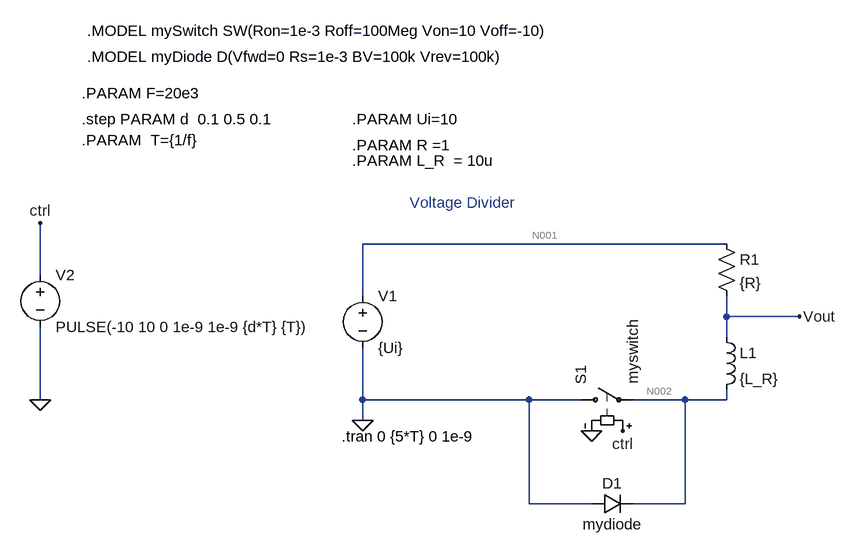
[diagram p0: schematic Switched_L.asc]
Switched_L.asc, the LTspice schematic file:
Version 4
SHEET 1 880 680
WIRE 560 80 0 80
WIRE -496 128 -496 48
WIRE 0 160 0 80
WIRE 560 192 560 160
WIRE 672 192 560 192
WIRE 560 224 560 192
WIRE -496 320 -496 208
WIRE 0 320 0 240
WIRE 256 320 0 320
WIRE 336 320 256 320
WIRE 496 320 416 320
WIRE 560 320 560 304
WIRE 560 320 496 320
WIRE 0 352 0 320
WIRE 256 480 256 320
WIRE 352 480 256 480
WIRE 496 480 496 320
WIRE 496 480 416 480
FLAG 0 352 0
FLAG 672 192 Vout
FLAG 352 368 0
FLAG 400 368 ctrl
FLAG -496 320 0
FLAG -496 48 ctrl
SYMBOL res 544 64 R0
SYMATTR InstName R1
SYMATTR Value {R}
SYMBOL voltage 0 144 R0
WINDOW 123 0 0 Left 0
WINDOW 39 0 0 Left 0
SYMATTR InstName V1
SYMATTR Value {Ui}
SYMBOL ind 544 208 R0
SYMATTR InstName L1
SYMATTR Value {L_R}
SYMBOL sw 320 320 R270
SYMATTR InstName S1
SYMATTR Value myswitch
SYMBOL voltage -496 112 R0
WINDOW 123 0 0 Left 0
WINDOW 39 0 0 Left 0
SYMATTR InstName V2
SYMATTR Value PULSE(-10 10 0 1e-9 1e-9 {d*T} {T})
SYMBOL diode 352 496 R270
WINDOW 0 32 32 VTop 2
WINDOW 3 0 32 VBottom 2
SYMATTR InstName D1
SYMATTR Value mydiode
TEXT -32 376 Left 2 !.tran 0 {5*T} 0 1e-9
TEXT 72 16 Left 2 ;Voltage Divider
TEXT -16 -112 Left 2 !.PARAM Ui=10
TEXT -16 -72 Left 2 !.PARAM R =1
TEXT -432 -152 Left 2 !.PARAM F=20e3
TEXT -432 -112 Left 2 !.step PARAM d  0.1 0.5 0.1
TEXT -432 -80 Left 2 !.PARAM  T={1/f}
TEXT -424 -248 Left 2 !.MODEL mySwitch SW(Ron=1e-3 Roff=100Meg Von=10 Voff=-10)
TEXT -424 -208 Left 2 !.MODEL myDiode D(Vfwd=0 Rs=1e-3 BV=100k Vrev=100k)
TEXT -16 -48 Left 2 !.PARAM L_R  = 10u

The netlist it stands for:
* Switched_L.asc
R1 N001 Vout {R}
V1 N001 0 {Ui}
L1 Vout N002 {L_R}
S1 0 N002 ctrl 0 myswitch
V2 ctrl 0 PULSE(-10 10 0 1e-9 1e-9 {d*T} {T})
D1 0 N002 mydiode
.model D D
.lib standard.dio
.tran 0 {5*T} 0 1e-9
* Voltage Divider
.PARAM Ui=10
.PARAM R =1
.PARAM F=20e3
.step PARAM d  0.1 0.5 0.1
.PARAM  T={1/f}
.MODEL mySwitch SW(Ron=1e-3 Roff=100Meg Von=10 Voff=-10)
.MODEL myDiode D(Vfwd=0 Rs=1e-3 BV=100k Vrev=100k)
.PARAM L_R  = 10u
.backanno
.end

* Results of the author's LTspice run, read from the files saved beside the schematic
* Operating Point (first step), zero values left out:
*   d = 100 m
*   V(n001) = 10 V
*   V(vout) = 10 V
*   V(n002) = 10 V
*   V(ctrl) = -10 V
*   I(D1) = -10.01 pA
*   I(L1) = 100 nA
*   I(R1) = 100 nA
*   I(S1) = 100 nA
*   I(V1) = -100 nA
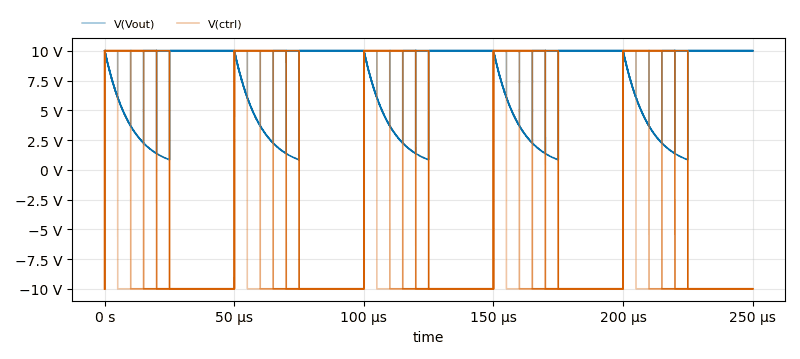
[diagram p1: Transient Analysis of Switched_L.asc, plotted from the saved traces]
* Transient Analysis, 5 runs:
*   V(Vout) [d=0.1]: min 6.067 V, max 10 V, average 9.787 V, rms 9.815 V, last 10 V
*   V(Vout) [d=0.2]: min 3.684 V, max 10.03 V, average 9.265 V, rms 9.416 V, last 10 V
*   V(Vout) [d=0.3]: min 2.24 V, max 10 V, average 8.556 V, rms 8.918 V, last 10 V
*   V(Vout) [d=0.4]: min 1.365 V, max 10.03 V, average 7.732 V, rms 8.357 V, last 10 V
*   V(Vout) [d=0.5]: min 835 mV, max 10 V, average 6.84 V, rms 7.744 V, last 10 V
*   V(ctrl) [d=0.1]: min -10 V, max 10 V, average -8 V, rms 10 V, last -10 V
*   V(ctrl) [d=0.2]: min -10 V, max 10 V, average -6 V, rms 10 V, last -10 V
*   V(ctrl) [d=0.3]: min -10 V, max 10 V, average -4 V, rms 10 V, last -10 V
*   V(ctrl) [d=0.4]: min -10 V, max 10 V, average -2 V, rms 10 V, last -10 V
*   V(ctrl) [d=0.5]: min -10 V, max 10 V, average 400 µV, rms 10 V, last -10 V